# Altium schematic sheet mainsche.SchDoc: SMART SPIROMETER SYSTEM
size A; DocumentNumber: PCB-01; Revision: V1.0; SheetNumber: 1; SheetTotal: 1; SPICEModelCacheCMYIDFSK: <root> / <DocumentId>CMYIDFSK</DocumentId> / <CacheFrame Number="0"> / <Model Name="led0" Kind="MDL"> / <Text>*Typ INFRARED GaAs LED: Vf=1.2V Vr=5V If=40mA trr=3uS / *LED Pinout: 1=A, 2=K / .MODEL LED0 D (IS=93.5P RS=84M N=2.63 BV=5 IBV=10U / + CJO=2.97P VJ=.75 M=.333 TT=4.32U)</Text> / </Model> / </CacheFrame> / </root>
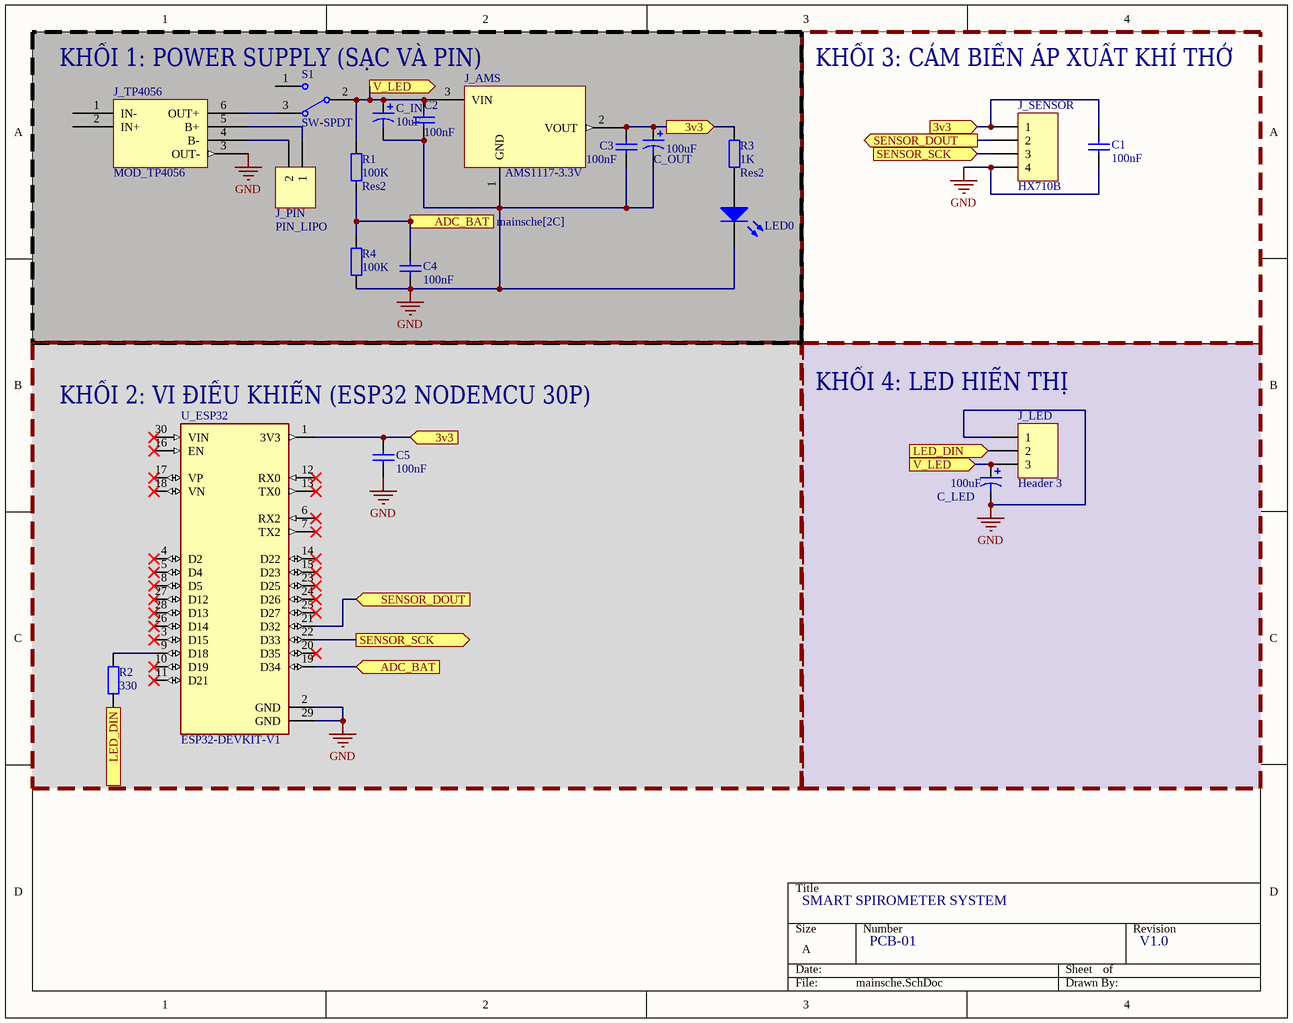
[diagram p0: mainsche.SchDoc]

## Parts
C1  value 100nF  [RAD-0.2]  (hidden comment: Cap)
C2  value 100nF  [RAD-0.2]  (hidden comment: Cap)
C3  value 100nF  [RAD-0.2]  (hidden comment: Cap)
C4  value 100nF  [RAD-0.2]  (hidden comment: Cap)
C5  value 100nF  [RAD-0.2]  (hidden comment: Cap)
C_IN  value 10uF  [RB5-10.5]  (hidden comment: Cap Pol1)
C_LED  value 100uF  [RB5-10.5]  (hidden comment: Cap Pol1)
C_OUT  value 100uF  [RB5-10.5]  (hidden comment: Cap Pol1)
D1  LED0  [LED-0]
J_AMS  AMS1117-3.3V  [SOT230P700X180-4M]
J_LED  Header 3  [HDR1X3]
J_PIN  PIN_LIPO  [HDR1X2]
J_SENSOR  HX710B  [HDR1X4]
J_TP4056  MOD_TP4056  [MOD_TP4056-Footprint-1]
R1  Res2  value 100K  [AXIAL-0.3]
R2  value 330  [AXIAL-0.3]  (hidden comment: Res2)
R3  Res2  value 1K  [AXIAL-0.3]
R4  value 100K  [AXIAL-0.3]  (hidden comment: Res2)
S1  SW-SPDT  [HDR1X3]
U_ESP32  ESP32-DEVKIT-V1  [MODULE_ESP32_DEVKIT_V1]

## Blocks framed on the sheet
KHỐI 1: POWER SUPPLY (SẠC VÀ PIN): C2-C4 C_IN C_OUT D1 J_AMS J_PIN J_TP4056 R1 R3 R4 S1
KHỐI 3: CẢM BIẾN ÁP XUẤT KHÍ THỞ: C1 J_SENSOR
KHỐI 2: VI ĐIỀU KHIỂN (ESP32 NODEMCU 30P): C5 R2 U_ESP32
KHỐI 4: LED HIỂN THỊ: C_LED J_LED

## Ports
3v3 (in, see mainsche[2B], mainsche[3A]), 3v3 (in, see mainsche[3A]), 3v3 (out, see mainsche[2B], mainsche[3A]), ADC_BAT (in, see mainsche[2A]), ADC_BAT (out, see mainsche[2C]), LED_DIN (in, see mainsche[1D]), LED_DIN (out, see mainsche[3B]), SENSOR_DOUT (in, see mainsche[3A]), SENSOR_DOUT (out, see mainsche[2C]), SENSOR_SCK (in, see mainsche[2C]), SENSOR_SCK (out, see mainsche[3A]), V_LED (in, see mainsche[2A]), V_LED (out, see mainsche[3B])

## Nets
GND: C1.1 C2.2 C3.1 C4.1 C5.1 C_IN.2 C_LED.2 C_OUT.2 D1.2(K) J_AMS.1(GND) J_LED.1 J_SENSOR.4 J_TP4056.3(OUT-) R4.1 U_ESP32.2(GND) U_ESP32.29(GND)
3v3: C1.2 C3.2 C5.2 C_OUT.1 J_AMS.2(VOUT) J_SENSOR.1 R3.2 U_ESP32.1(3V3) ; port 3v3
ADC_BAT: C4.2 R1.1 R4.2 U_ESP32.19(D34) ; port ADC_BAT
LED_DIN: J_LED.2 R2.1 ; port LED_DIN
SENSOR_DOUT: J_SENSOR.2 U_ESP32.21(D32) ; port SENSOR_DOUT
SENSOR_SCK: J_SENSOR.3 U_ESP32.22(D33) ; port SENSOR_SCK
V_LED: C2.1 C_IN.1 C_LED.1 J_AMS.3(VIN) J_LED.3 R1.2 S1.2 ; port V_LED
NetD1_1: D1.1(A) R3.1
NetJ_PIN_1: J_PIN.1 J_TP4056.5(B+)
NetJ_PIN_2: J_PIN.2 J_TP4056.4(B-)
NetJ_TP4056_6: J_TP4056.6(OUT+) S1.3
NetR2_2: R2.2 U_ESP32.9(D18)

Not connected (* = marked no-connect by the designer): J_TP4056 1(IN-) 2(IN+); S1 1; U_ESP32 3(D15)* 4(D2)* 5(D4)* 6(RX2)* 7(TX2)* 8(D5)* 10(D19)* 11(D21)* 12(RX0)* 13(TX0)* 14(D22)* 15(D23)* 16(EN)* 17(VP)* 18(VN)* 20(D35)* 23(D25)* 24(D26)* 25(D27)* 26(D14)* 27(D12)* 28(D13)* 30(VIN)*

## Library data of the parts
C1-C5 = Cap: Capacitor; Published: 8-Jun-2000; LatestRevisionDate: 17-Jul-2002; LatestRevisionNote: Re-released for DXP Platform.; PackageReference: RAD-0.3; Publisher: Altium Limited; PackageDescription: Radial Cap, Thru-Hole; 2 Leads; 0.3 in Pin Spacing
C_IN C_LED C_OUT = Cap Pol1: Polarized Capacitor (Radial); Published: 8-Jun-2000; LatestRevisionDate: 17-Jul-2002; LatestRevisionNote: Re-released for DXP Platform.; PackageReference: RB7.6-15; Publisher: Altium Limited; PackageDescription: Polarized Capacitor (Radial); 2 Leads
D1 = LED0: Typical INFRARED GaAs LED; Published: 8-Jun-2000; LatestRevisionDate: 08-Jul-2005; LatestRevisionNote: Mech Layer 1 removed.; PackageReference: LED-0; Publisher: Altium Limited; PackageDescription: LED; 2 Leads
J_AMS = CMP-019-00050-1: 1A Fixed 3.3V 18V SOT-223 Voltage Regulators - Linear, Low Drop Out (LDO) Regulators ROHS
J_LED = Header 3: Header, 3-Pin; LatestRevisionDate: 17-Jul-2002; LatestRevisionNote: Re-released for DXP Platform.; Publisher: Altium Limited
J_PIN = Header 2: Header, 2-Pin; LatestRevisionDate: 17-Jul-2002; LatestRevisionNote: Re-released for DXP Platform.; Publisher: Altium Limited
J_SENSOR = Header 4: Header, 4-Pin; LatestRevisionDate: 17-Jul-2002; LatestRevisionNote: Re-released for DXP Platform.; Publisher: Altium Limited
J_TP4056 = CMP-00029-00001-4
R1-R4 = Res2: Resistor; Published: 8-Jun-2000; LatestRevisionDate: 17-Jul-2002; LatestRevisionNote: Re-released for DXP Platform.; PackageReference: AXIAL-0.4; Publisher: Altium Limited; PackageDescription: Axial Device, Thru-Hole; 2 Leads; 0.4 in Pin Spacing
S1 = SW-SPDT: SPDT Subminiature Toggle Switch, Right Angle Mounting, Vertical Actuation; Published: 24-Mar-1999; LatestRevisionDate: 17-Dec-2003; LatestRevisionNote: Schematic revised, PCB Footprint replaced.; DatasheetVersion: 05-Dec-2000; PackageReference: TL36WW15050; Publisher: Altium Limited; PackageDescription: Switch; 4 Leads; ComponentLink1Description: Manufacturer Link; ComponentLink1URL: http://www.apem.com
U_ESP32 = ESP32-DEVKIT-V1: Dual core, Wi-Fi: 2.4 GHz up to 150 Mbits/s,BLE (Bluetooth Low Energy) and legacy Bluetooth, 32 bits, Up to 240 MHz; MF: Do it; SnapEDA_Link: https://www.snapeda.com/parts/ESP32-DEVKIT-V1/Do+it/view-part/?ref=snap; Package: None; Value: *; MP: ESP32-DEVKIT-V1; Check_prices: https://www.snapeda.com/parts/ESP32-DEVKIT-V1/Do+it/view-part/?ref=eda